# Altium schematic sheet Power.SchDoc
size A3; SheetNumber: 5; SheetTotal: 5
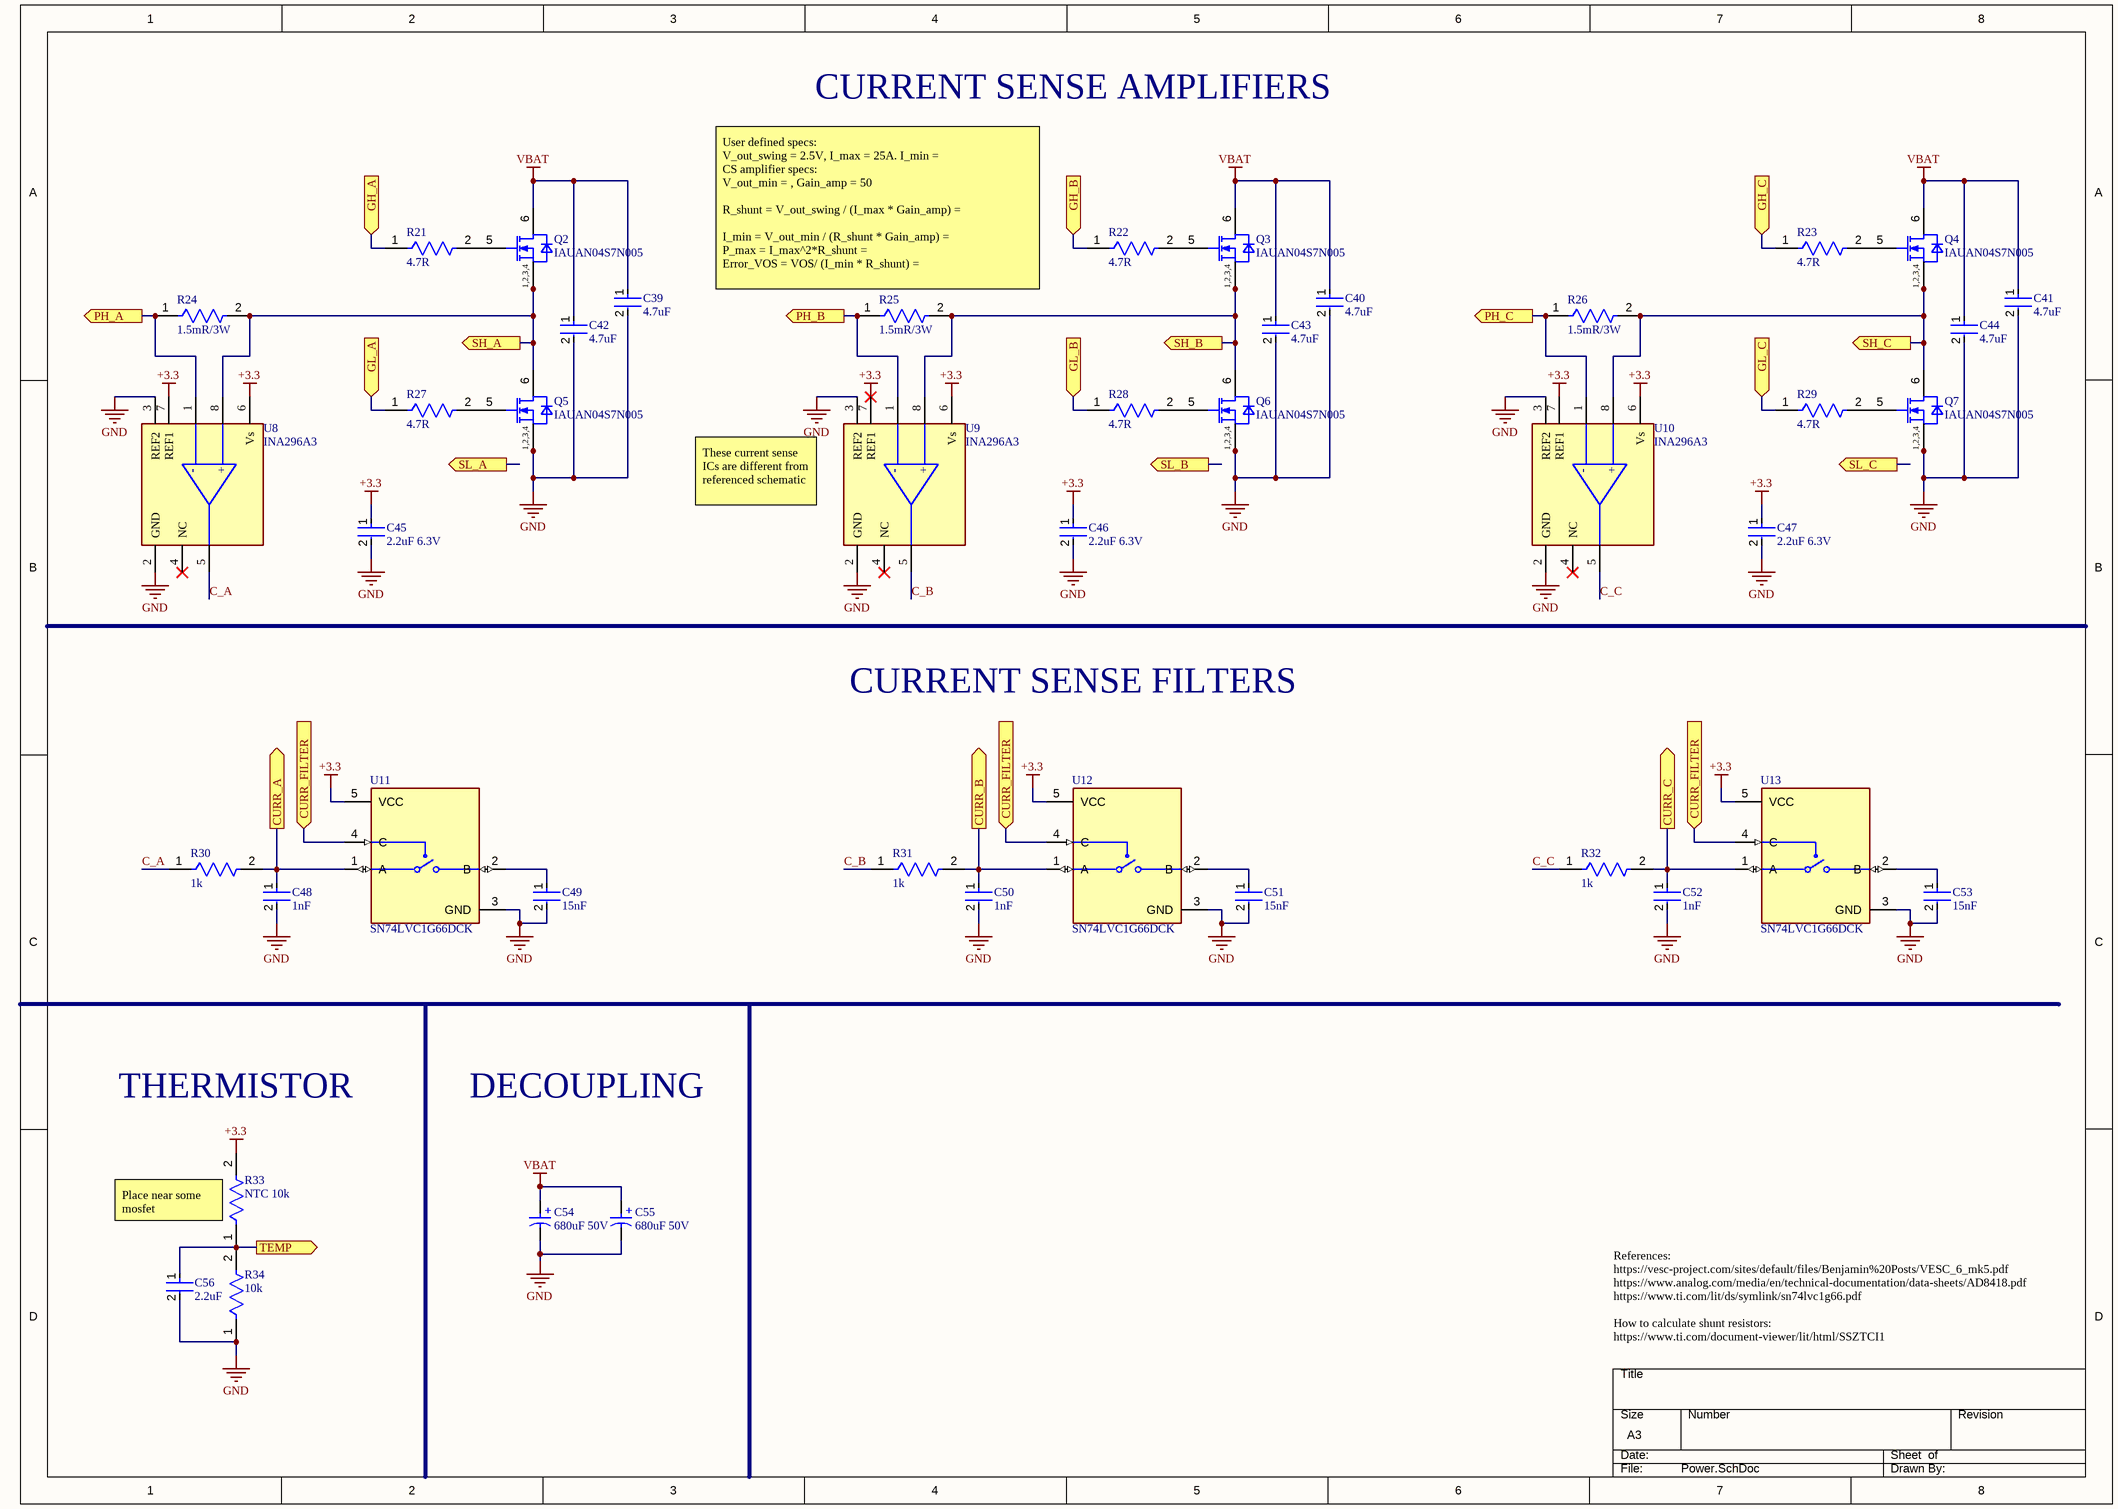
[diagram p0: Power.SchDoc]

## Parts
C39  4.7uF  [FP-CC0805-0_85-MFG]
C40  4.7uF  [FP-CC0805-0_85-MFG]
C41  4.7uF  [FP-CC0805-0_85-MFG]
C42  4.7uF  [FP-CC0805-0_85-MFG]
C43  4.7uF  [FP-CC0805-0_85-MFG]
C44  4.7uF  [FP-CC0805-0_85-MFG]
C45  2.2uF 6.3V  [FP-CC0402-MFG]
C46  2.2uF 6.3V  [FP-CC0402-MFG]
C47  2.2uF 6.3V  [FP-CC0402-MFG]
C48  1nF  [FP-CC0402-MFG]
C49  15nF  [FP-CC0402-MFG]
C50  1nF  [FP-CC0402-MFG]
C51  15nF  [FP-CC0402-MFG]
C52  1nF  [FP-CC0402-MFG]
C53  15nF  [FP-CC0402-MFG]
C54  680uF 50V  [WCAP-ATG5_D13H20_BENT_MIRROR]
C55  680uF 50V  [WCAP-ATG5_D13H20_BENT_MIRROR]
C56  2.2uF  [FP-CC0805-0_85-MFG]
Q2  IAUAN04S7N005  [IFX-PG-HSOF-5-1-V]
Q3  IAUAN04S7N005  [IFX-PG-HSOF-5-1-V]
Q4  IAUAN04S7N005  [IFX-PG-HSOF-5-1-V]
Q5  IAUAN04S7N005  [IFX-PG-HSOF-5-1-V]
Q6  IAUAN04S7N005  [IFX-PG-HSOF-5-1-V]
Q7  IAUAN04S7N005  [IFX-PG-HSOF-5-1-V]
R21  4.7R  [FP-AC0402-MFG]
R22  4.7R  [FP-AC0402-MFG]
R23  4.7R  [FP-AC0402-MFG]
R24  1.5mR/3W  [FP-AC2512-MFG]
R25  1.5mR/3W  [FP-AC2512-MFG]
R26  1.5mR/3W  [FP-AC2512-MFG]
R27  4.7R  [FP-AC0402-MFG]
R28  4.7R  [FP-AC0402-MFG]
R29  4.7R  [FP-AC0402-MFG]
R30  1k  [FP-AC0402-MFG]
R31  1k  [FP-AC0402-MFG]
R32  1k  [FP-AC0402-MFG]
R33  NTC 10k  [FP-AC0402-MFG]
R34  10k  [FP-AC0402-MFG]
U8  INA296A3  [FP-DDF0008A-MFG]
U9  INA296A3  [FP-DDF0008A-MFG]
U10  INA296A3  [FP-DDF0008A-MFG]
U11  SN74LVC1G66DCK  [FP-DCK0005A-MFG]
U12  SN74LVC1G66DCK  [FP-DCK0005A-MFG]
U13  SN74LVC1G66DCK  [FP-DCK0005A-MFG]

## Ports
CURR_A (out, see Main[4C]), CURR_B (out, see Main[4C]), CURR_C (out, see Main[4C]), CURR_FILTER (in, see Main[4C]), GH_A (in, see Main[4A], DRV8301[3B]), GH_B (in, see Main[4B], DRV8301[3B]), GH_C (in, see Main[4B], DRV8301[3B]), GL_A (in, see Main[4B], DRV8301[3B]), GL_B (in, see Main[4B], DRV8301[3B]), GL_C (in, see Main[4B], DRV8301[3B]), PH_A (out, see Main[4B]), PH_B (out, see Main[4B]), PH_C (out, see Main[4B]), SH_A (out, see Main[4B], DRV8301[1C], DRV8301[4B]), SH_B (out, see Main[4B], DRV8301[4B], DRV8301[4C]), SH_C (out, see Main[4B], DRV8301[3D], DRV8301[4B]), SL_A (out, see Main[4B]), SL_B (out, see Main[4B]), SL_C (out, see Main[4B]), TEMP (out, see Main[4C])

## Nets
+3.3: C45.1 C46.1 C47.1 R33.2 U8.6(Vs) U8.7(REF1) U9.6(Vs) U9.7(REF1) U10.6(Vs) U10.7(REF1) U11.5(VCC) U12.5(VCC) U13.5(VCC)
GND: C39.2 C40.2 C41.2 C42.2 C43.2 C44.2 C45.2 C46.2 C47.2 C48.2 C49.2 C50.2 C51.2 C52.2 C53.2 C54.2(N) C55.2(N) C56.2 Q5.1(S1) Q5.2(S2) Q5.3(S3) Q5.4(S4) Q6.1(S1) Q6.2(S2) Q6.3(S3) Q6.4(S4) Q7.1(S1) Q7.2(S2) Q7.3(S3) Q7.4(S4) R34.1 U8.2(GND) U8.3(REF2) U9.2(GND) U9.3(REF2) U10.2(GND) U10.3(REF2) U11.3(GND) U12.3(GND) U13.3(GND)
VBAT: C39.1 C40.1 C41.1 C42.1 C43.1 C44.1 C54.1(P) C55.1(P) Q2.6(D) Q3.6(D) Q4.6(D)
C_A: R30.1 U8.5(OUT)
C_B: R31.1 U9.5(OUT)
C_C: R32.1 U10.5(OUT)
CURR_A: C48.1 R30.2 U11.1(A) ; port CURR_A
CURR_B: C50.1 R31.2 U12.1(A) ; port CURR_B
CURR_C: C52.1 R32.2 U13.1(A) ; port CURR_C
CURR_FILTER: U11.4(C) U12.4(C) U13.4(C) ; port CURR_FILTER
GH_A: R21.1 ; port GH_A
GH_B: R22.1 ; port GH_B
GH_C: R23.1 ; port GH_C
GL_A: R27.1 ; port GL_A
GL_B: R28.1 ; port GL_B
GL_C: R29.1 ; port GL_C
PH_A: R24.1 U8.1(IN-) ; port PH_A
PH_B: R25.1 U9.1(IN-) ; port PH_B
PH_C: R26.1 U10.1(IN-) ; port PH_C
SH_A: Q2.1(S1) Q2.2(S2) Q2.3(S3) Q2.4(S4) Q5.6(D) R24.2 U8.8(IN+) ; port SH_A
SH_B: Q3.1(S1) Q3.2(S2) Q3.3(S3) Q3.4(S4) Q6.6(D) R25.2 U9.8(IN+) ; port SH_B
SH_C: Q4.1(S1) Q4.2(S2) Q4.3(S3) Q4.4(S4) Q7.6(D) R26.2 U10.8(IN+) ; port SH_C
TEMP: C56.1 R33.1 R34.2 ; port TEMP
NetC49_1: C49.1 U11.2(B)
NetC51_1: C51.1 U12.2(B)
NetC53_1: C53.1 U13.2(B)
NetQ2_5: Q2.5(G) R21.2
NetQ3_5: Q3.5(G) R22.2
NetQ4_5: Q4.5(G) R23.2
NetQ5_5: Q5.5(G) R27.2
NetQ6_5: Q6.5(G) R28.2
NetQ7_5: Q7.5(G) R29.2

Not connected (* = marked no-connect by the designer): U8 4(NC)*; U9 4(NC)*; U10 4(NC)*

## Notes on the sheet
- CURRENT SENSE AMPLIFIERS
- (near R25) User defined specs:
  V_out_swing = 2.5V, I_max = 25A. I_min =
  CS amplifier specs:
  V_out_min = , Gain_amp = 50
  R_shunt = V_out_swing / (I_max * Gain_amp) =
  I_min = V_out_min / (R_shunt * Gain_amp) =
  P_max = I_max^2*R_shunt =
  Error_VOS = VOS/ (I_min * R_shunt) =
- (near U9) These current sense ICs are different from referenced schematic
- CURRENT SENSE FILTERS
- THERMISTOR
- DECOUPLING
- (near R33) Place near some mosfet
- References:
  https://vesc-project.com/sites/default/files/Benjamin%20Posts/VESC_6_mk5.pdf
  https://www.analog.com/media/en/technical-documentation/data-sheets/AD8418.pdf
  https://www.ti.com/lit/ds/symlink/sn74lvc1g66.pdf
  How to calculate shunt resistors:
  https://www.ti.com/document-viewer/lit/html/SSZTCI1
- DWG. NO.
- REV.
- SHT.
- REVISION
- DESCRIPTION
- DATE
- APPROVED
- THIS DOCUMENT AND THE DATA DISCLOSED HEREIN OR HEREWITH IS THE PROPERTY OF ALTIUM LIMITED AND MAY BE FREELY DISTRIBUTED IN WHOLE. NO RIGHTS ARE RESERVED OR EXPRESS OR IMPLIED WARANTEE GIVEN.
- ENG:
- DSN:
- APPROVALS
- PROJECT
- DOCUMENT REVISION:
- DESIGN ITEM:
- CHK:
- BOM:
- REFERENCE DOCUMENTS
- PROJECT REVISION:
- TITLE
- FAB DWG:
- PCB DWG:
- ASSY DWG:
- SCALE:
- SIZE
- C
- CAGE CODE
- FILE NAME
- DWG NO.
- SHEET
- OF
- REV
- (in symbol 860020678024) +
- (in symbol IAUAN04S7N005) 1,2,3,4
- (in symbol INA296A3IDDFR) -; +

## Library data of the parts
C39-C44 = 0805B475K500NT: 4.7uF 50V X7R ±10% 0805 Multilayer Ceramic Capacitors MLCC - SMD/SMT ROHS; Manufacturer: Yageo Group; Manufacturer Part Number: CC0402KRX7R9BB682; Value: 6.8nF; Temperature Coefficient: 30ppm/°C; Supplier: DigiKey; Supplier Part Number: 311-1726-1-ND; RoHS: Compliant; Category: Ceramic Capacitors; Stock: 93415; Pricing: 1=0.1, 10=0.024, 50=0.0156, 100=0.0133, 500=0.00934, 1000=0.00812, 2500=0.00685, 5000=0.00609 (USD); Case/Package: 0402; Case Code (Imperial): 0402; Case Code (Metric): 1005; China RoHS: Compliant; Composition: Ceramic; Depth: 500µm; Dielectric: X7R; Dielectric Material: Ceramic; Halogen Free: Halogen Free; Height: 500µm; Lead Free: Lead Free; Length: 1mm; Lifecycle Status: Production; Material: Ceramic; Max Operating Temperature: 125°C; Min Operating Temperature: -55°C; Mounting Technology: Surface Mount; Pins: 2; Number of Terminals: 2; Packaging: Tape and Reel; Radiation Hardening: No; REACH SVHC: Yes; Schedule B: 8532240020, 8532240020|8532240020|8532240020|8532240020|8532240020|8532240020|8532240020|8532240020|8532240020|8532240020|8532240020|8532240020|8532240020|8532240020|8532240020|8532240020|8532240020|8532240020|8532240020|8532240020|8532240020|8532240020|8532240020|85; Termination: SMD/SMT; Thickness: 558.8µm; Tolerance: 10%; Voltage: 50V; Voltage Rating: 50V; Voltage Rating (DC): 50V; Weight: 652.039032µg; Width: 500µm; ComponentLink1URL: https://datasheet.octopart.com:443/CC0402KRX7R9BB682-Yageo-datasheet-177165144.pdf?src-supplier=IHS; ComponentLink1Description: https://datasheet.octopart.com:443/CC0402KRX7R9BB682-Yageo-datasheet-177165144.pdf?src-supplier=IHS; ComponentLink2URL: https://datasheet.octopart.com:443/CC0402KRX7R9BB682-Yageo-datasheet-78855684.pdf?src-supplier=Upverter; ComponentLink2Description: https://datasheet.octopart.com:443/CC0402KRX7R9BB682-Yageo-datasheet-78855684.pdf?src-supplier=Upverter; ComponentLink3URL: https://datasheet.octopart.com:443/CC0402KRX7R9BB682-Yageo-datasheet-147453679.pdf?src-supplier=Farnell; ComponentLink3Description: https://datasheet.octopart.com:443/CC0402KRX7R9BB682-Yageo-datasheet-147453679.pdf?src-supplier=Farnell; ComponentLink4URL: https://datasheet.octopart.com:443/CC0402KRX7R9BB682-Yageo-datasheet-182029474.pdf?src-supplier=Farnell; ComponentLink4Description: https://datasheet.octopart.com:443/CC0402KRX7R9BB682-Yageo-datasheet-182029474.pdf?src-supplier=Farnell; ComponentLink5URL: https://datasheet.octopart.com:443/CC0402KRX7R9BB682-Yageo-datasheet-140260305.pdf?src-supplier=element14+APAC; ComponentLink5Description: https://datasheet.octopart.com:443/CC0402KRX7R9BB682-Yageo-datasheet-140260305.pdf?src-supplier=element14+APAC; ComponentLink6URL: https://datasheet.octopart.com/CC0402KRX7R9BB682-Yageo-datasheet-10883670.pdf; ComponentLink6Description: https://datasheet.octopart.com/CC0402KRX7R9BB682-Yageo-datasheet-10883670.pdf; ComponentLink7URL: https://datasheet.octopart.com:443/CC0402KRX7R9BB682-Yageo-datasheet-166511530.pdf?src-supplier=Future+Electronics; ComponentLink7Description: https://datasheet.octopart.com:443/CC0402KRX7R9BB682-Yageo-datasheet-166511530.pdf?src-supplier=Future+Electronics; ComponentLink8URL: https://datasheet.octopart.com:443/CC0402KRX7R9BB682-Yageo-datasheet-137700082.pdf?src-supplier=Future+Electronics; ComponentLink8Description: https://datasheet.octopart.com:443/CC0402KRX7R9BB682-Yageo-datasheet-137700082.pdf?src-supplier=Future+Electronics; ComponentLink9URL: https://datasheet.octopart.com:443/CC0402KRX7R9BB682-Yageo-datasheet-137700084.pdf?src-supplier=Future+Electronics; ComponentLink9Description: https://datasheet.octopart.com:443/CC0402KRX7R9BB682-Yageo-datasheet-137700084.pdf?src-supplier=Future+Electronics; ComponentLink10URL: https://datasheet.octopart.com:443/CC0402KRX7R9BB682-Yageo-datasheet-27626582.pdf?src-supplier=Future+Electronics; ComponentLink10Description: https://datasheet.octopart.com:443/CC0402KRX7R9BB682-Yageo-datasheet-27626582.pdf?src-supplier=Future+Electronics; ComponentLink11URL: https://datasheet.octopart.com:443/CC0402KRX7R9BB682-Yageo-datasheet-24578986.pdf?src-supplier=Future+Electronics; ComponentLink11Description: https://datasheet.octopart.com:443/CC0402KRX7R9BB682-Yageo-datasheet-24578986.pdf?src-supplier=Future+Electronics; ComponentLink12URL: https://datasheet.octopart.com:443/CC0402KRX7R9BB682-Yageo-datasheet-15895757.pdf?src-supplier=Future+Electronics; ComponentLink12Description: https://datasheet.octopart.com:443/CC0402KRX7R9BB682-Yageo-datasheet-15895757.pdf?src-supplier=Future+Electronics; ComponentLink13URL: https://datasheet.octopart.com:443/CC0402KRX7R9BB682-Yageo-datasheet-12526321.pdf?src-supplier=Future+Electronics; ComponentLink13Description: https://datasheet.octopart.com:443/CC0402KRX7R9BB682-Yageo-datasheet-12526321.pdf?src-supplier=Future+Electronics; ComponentLink14URL: https://datasheet.octopart.com:443/CC0402KRX7R9BB682-Yageo-datasheet-178018872.pdf?src-supplier=Burklin+Elektronik; ComponentLink14Description: https://datasheet.octopart.com:443/CC0402KRX7R9BB682-Yageo-datasheet-178018872.pdf?src-supplier=Burklin+Elektronik; ComponentLink15URL: https://datasheet.octopart.com:443/CC0402KRX7R9BB682-Yageo-Group-datasheet-165992755.pdf?src-supplier=ODG+(Origin+Data+Global); ComponentLink15Description: https://datasheet.octopart.com:443/CC0402KRX7R9BB682-Yageo-Group-datasheet-165992755.pdf?src-supplier=ODG+(Origin+Data+Global); ComponentLink16URL: https://datasheet.octopart.com:443/CC0402KRX7R9BB682-Yageo-datasheet-120101875.pdf?src-supplier=Megastar; ComponentLink16Description: https://datasheet.octopart.com:443/CC0402KRX7R9BB682-Yageo-datasheet-120101875.pdf?src-supplier=Megastar; ComponentLink17URL: https://datasheet.octopart.com:443/CC0402KRX7R9BB682-Yageo-datasheet-62336348.pdf?src-supplier=Newark; ComponentLink17Description: https://datasheet.octopart.com:443/CC0402KRX7R9BB682-Yageo-datasheet-62336348.pdf?src-supplier=Newark; ComponentLink18URL: http://sigma.octopart.com:80/conflict_mineral_statement/Yageo-company-3.pdf?src-supplier=Compliance+Statements; ComponentLink18Description: http://sigma.octopart.com:80/conflict_mineral_statement/Yageo-company-3.pdf?src-supplier=Compliance+Statements; ComponentLink19URL: http://sigma.octopart.com:80/rohs_statement/Yageo-company-2.pdf?src-supplier=Compliance+Statements; ComponentLink19Description: http://sigma.octopart.com:80/rohs_statement/Yageo-company-2.pdf?src-supplier=Compliance+Statements
C45-C47 = CL05A225MQ5NSNC: 2.2uF 6.3V X5R ±20% 0402 Multilayer Ceramic Capacitors MLCC - SMD/SMT ROHS; Manufacturer: Yageo Group; Manufacturer Part Number: CC0402KRX7R9BB682; Value: 6.8nF; Dielectric: X7R; Temperature Coefficient: 30ppm/°C; Tolerance: 10%; Voltage: 50V; Supplier: DigiKey; Supplier Part Number: 311-1726-1-ND; RoHS: Compliant; Category: Ceramic Capacitors; Stock: 93415; Pricing: 1=0.1, 10=0.024, 50=0.0156, 100=0.0133, 500=0.00934, 1000=0.00812, 2500=0.00685, 5000=0.00609 (USD); Case/Package: 0402; Case Code (Imperial): 0402; Case Code (Metric): 1005; China RoHS: Compliant; Composition: Ceramic; Depth: 500µm; Dielectric Material: Ceramic; Halogen Free: Halogen Free; Height: 500µm; Lead Free: Lead Free; Length: 1mm; Lifecycle Status: Production; Material: Ceramic; Max Operating Temperature: 125°C; Min Operating Temperature: -55°C; Mounting Technology: Surface Mount; Pins: 2; Number of Terminals: 2; Packaging: Tape and Reel; Radiation Hardening: No; REACH SVHC: Yes; Schedule B: 8532240020, 8532240020|8532240020|8532240020|8532240020|8532240020|8532240020|8532240020|8532240020|8532240020|8532240020|8532240020|8532240020|8532240020|8532240020|8532240020|8532240020|8532240020|8532240020|8532240020|8532240020|8532240020|8532240020|8532240020|85; Termination: SMD/SMT; Thickness: 558.8µm; Voltage Rating: 50V; Voltage Rating (DC): 50V; Weight: 652.039032µg; Width: 500µm; ComponentLink1URL: https://datasheet.octopart.com:443/CC0402KRX7R9BB682-Yageo-datasheet-177165144.pdf?src-supplier=IHS; ComponentLink1Description: https://datasheet.octopart.com:443/CC0402KRX7R9BB682-Yageo-datasheet-177165144.pdf?src-supplier=IHS; ComponentLink2URL: https://datasheet.octopart.com:443/CC0402KRX7R9BB682-Yageo-datasheet-78855684.pdf?src-supplier=Upverter; ComponentLink2Description: https://datasheet.octopart.com:443/CC0402KRX7R9BB682-Yageo-datasheet-78855684.pdf?src-supplier=Upverter; ComponentLink3URL: https://datasheet.octopart.com:443/CC0402KRX7R9BB682-Yageo-datasheet-147453679.pdf?src-supplier=Farnell; ComponentLink3Description: https://datasheet.octopart.com:443/CC0402KRX7R9BB682-Yageo-datasheet-147453679.pdf?src-supplier=Farnell; ComponentLink4URL: https://datasheet.octopart.com:443/CC0402KRX7R9BB682-Yageo-datasheet-182029474.pdf?src-supplier=Farnell; ComponentLink4Description: https://datasheet.octopart.com:443/CC0402KRX7R9BB682-Yageo-datasheet-182029474.pdf?src-supplier=Farnell; ComponentLink5URL: https://datasheet.octopart.com:443/CC0402KRX7R9BB682-Yageo-datasheet-140260305.pdf?src-supplier=element14+APAC; ComponentLink5Description: https://datasheet.octopart.com:443/CC0402KRX7R9BB682-Yageo-datasheet-140260305.pdf?src-supplier=element14+APAC; ComponentLink6URL: https://datasheet.octopart.com/CC0402KRX7R9BB682-Yageo-datasheet-10883670.pdf; ComponentLink6Description: https://datasheet.octopart.com/CC0402KRX7R9BB682-Yageo-datasheet-10883670.pdf; ComponentLink7URL: https://datasheet.octopart.com:443/CC0402KRX7R9BB682-Yageo-datasheet-166511530.pdf?src-supplier=Future+Electronics; ComponentLink7Description: https://datasheet.octopart.com:443/CC0402KRX7R9BB682-Yageo-datasheet-166511530.pdf?src-supplier=Future+Electronics; ComponentLink8URL: https://datasheet.octopart.com:443/CC0402KRX7R9BB682-Yageo-datasheet-137700082.pdf?src-supplier=Future+Electronics; ComponentLink8Description: https://datasheet.octopart.com:443/CC0402KRX7R9BB682-Yageo-datasheet-137700082.pdf?src-supplier=Future+Electronics; ComponentLink9URL: https://datasheet.octopart.com:443/CC0402KRX7R9BB682-Yageo-datasheet-137700084.pdf?src-supplier=Future+Electronics; ComponentLink9Description: https://datasheet.octopart.com:443/CC0402KRX7R9BB682-Yageo-datasheet-137700084.pdf?src-supplier=Future+Electronics; ComponentLink10URL: https://datasheet.octopart.com:443/CC0402KRX7R9BB682-Yageo-datasheet-27626582.pdf?src-supplier=Future+Electronics; ComponentLink10Description: https://datasheet.octopart.com:443/CC0402KRX7R9BB682-Yageo-datasheet-27626582.pdf?src-supplier=Future+Electronics; ComponentLink11URL: https://datasheet.octopart.com:443/CC0402KRX7R9BB682-Yageo-datasheet-24578986.pdf?src-supplier=Future+Electronics; ComponentLink11Description: https://datasheet.octopart.com:443/CC0402KRX7R9BB682-Yageo-datasheet-24578986.pdf?src-supplier=Future+Electronics; ComponentLink12URL: https://datasheet.octopart.com:443/CC0402KRX7R9BB682-Yageo-datasheet-15895757.pdf?src-supplier=Future+Electronics; ComponentLink12Description: https://datasheet.octopart.com:443/CC0402KRX7R9BB682-Yageo-datasheet-15895757.pdf?src-supplier=Future+Electronics; ComponentLink13URL: https://datasheet.octopart.com:443/CC0402KRX7R9BB682-Yageo-datasheet-12526321.pdf?src-supplier=Future+Electronics; ComponentLink13Description: https://datasheet.octopart.com:443/CC0402KRX7R9BB682-Yageo-datasheet-12526321.pdf?src-supplier=Future+Electronics; ComponentLink14URL: https://datasheet.octopart.com:443/CC0402KRX7R9BB682-Yageo-datasheet-178018872.pdf?src-supplier=Burklin+Elektronik; ComponentLink14Description: https://datasheet.octopart.com:443/CC0402KRX7R9BB682-Yageo-datasheet-178018872.pdf?src-supplier=Burklin+Elektronik; ComponentLink15URL: https://datasheet.octopart.com:443/CC0402KRX7R9BB682-Yageo-Group-datasheet-165992755.pdf?src-supplier=ODG+(Origin+Data+Global); ComponentLink15Description: https://datasheet.octopart.com:443/CC0402KRX7R9BB682-Yageo-Group-datasheet-165992755.pdf?src-supplier=ODG+(Origin+Data+Global); ComponentLink16URL: https://datasheet.octopart.com:443/CC0402KRX7R9BB682-Yageo-datasheet-120101875.pdf?src-supplier=Megastar; ComponentLink16Description: https://datasheet.octopart.com:443/CC0402KRX7R9BB682-Yageo-datasheet-120101875.pdf?src-supplier=Megastar; ComponentLink17URL: https://datasheet.octopart.com:443/CC0402KRX7R9BB682-Yageo-datasheet-62336348.pdf?src-supplier=Newark; ComponentLink17Description: https://datasheet.octopart.com:443/CC0402KRX7R9BB682-Yageo-datasheet-62336348.pdf?src-supplier=Newark; ComponentLink18URL: http://sigma.octopart.com:80/conflict_mineral_statement/Yageo-company-3.pdf?src-supplier=Compliance+Statements; ComponentLink18Description: http://sigma.octopart.com:80/conflict_mineral_statement/Yageo-company-3.pdf?src-supplier=Compliance+Statements; ComponentLink19URL: http://sigma.octopart.com:80/rohs_statement/Yageo-company-2.pdf?src-supplier=Compliance+Statements; ComponentLink19Description: http://sigma.octopart.com:80/rohs_statement/Yageo-company-2.pdf?src-supplier=Compliance+Statements
C48 C50 C52 = 0402B102K500NT: 1nF 50V X7R ±10% 0402 Multilayer Ceramic Capacitors MLCC - SMD/SMT ROHS; Manufacturer: Yageo Group; Manufacturer Part Number: CC0402KRX7R9BB682; Value: 6.8nF; Temperature Coefficient: 30ppm/°C; Supplier: DigiKey; Supplier Part Number: 311-1726-1-ND; RoHS: Compliant; Category: Ceramic Capacitors; Stock: 93415; Pricing: 1=0.1, 10=0.024, 50=0.0156, 100=0.0133, 500=0.00934, 1000=0.00812, 2500=0.00685, 5000=0.00609 (USD); Case/Package: 0402; Case Code (Imperial): 0402; Case Code (Metric): 1005; China RoHS: Compliant; Composition: Ceramic; Depth: 500µm; Dielectric: X7R; Dielectric Material: Ceramic; Halogen Free: Halogen Free; Height: 500µm; Lead Free: Lead Free; Length: 1mm; Lifecycle Status: Production; Material: Ceramic; Max Operating Temperature: 125°C; Min Operating Temperature: -55°C; Mounting Technology: Surface Mount; Pins: 2; Number of Terminals: 2; Packaging: Tape and Reel; Radiation Hardening: No; REACH SVHC: Yes; Schedule B: 8532240020, 8532240020|8532240020|8532240020|8532240020|8532240020|8532240020|8532240020|8532240020|8532240020|8532240020|8532240020|8532240020|8532240020|8532240020|8532240020|8532240020|8532240020|8532240020|8532240020|8532240020|8532240020|8532240020|8532240020|85; Termination: SMD/SMT; Thickness: 558.8µm; Tolerance: 10%; Voltage: 50V; Voltage Rating: 50V; Voltage Rating (DC): 50V; Weight: 652.039032µg; Width: 500µm; ComponentLink1URL: https://datasheet.octopart.com:443/CC0402KRX7R9BB682-Yageo-datasheet-177165144.pdf?src-supplier=IHS; ComponentLink1Description: https://datasheet.octopart.com:443/CC0402KRX7R9BB682-Yageo-datasheet-177165144.pdf?src-supplier=IHS; ComponentLink2URL: https://datasheet.octopart.com:443/CC0402KRX7R9BB682-Yageo-datasheet-78855684.pdf?src-supplier=Upverter; ComponentLink2Description: https://datasheet.octopart.com:443/CC0402KRX7R9BB682-Yageo-datasheet-78855684.pdf?src-supplier=Upverter; ComponentLink3URL: https://datasheet.octopart.com:443/CC0402KRX7R9BB682-Yageo-datasheet-147453679.pdf?src-supplier=Farnell; ComponentLink3Description: https://datasheet.octopart.com:443/CC0402KRX7R9BB682-Yageo-datasheet-147453679.pdf?src-supplier=Farnell; ComponentLink4URL: https://datasheet.octopart.com:443/CC0402KRX7R9BB682-Yageo-datasheet-182029474.pdf?src-supplier=Farnell; ComponentLink4Description: https://datasheet.octopart.com:443/CC0402KRX7R9BB682-Yageo-datasheet-182029474.pdf?src-supplier=Farnell; ComponentLink5URL: https://datasheet.octopart.com:443/CC0402KRX7R9BB682-Yageo-datasheet-140260305.pdf?src-supplier=element14+APAC; ComponentLink5Description: https://datasheet.octopart.com:443/CC0402KRX7R9BB682-Yageo-datasheet-140260305.pdf?src-supplier=element14+APAC; ComponentLink6URL: https://datasheet.octopart.com/CC0402KRX7R9BB682-Yageo-datasheet-10883670.pdf; ComponentLink6Description: https://datasheet.octopart.com/CC0402KRX7R9BB682-Yageo-datasheet-10883670.pdf; ComponentLink7URL: https://datasheet.octopart.com:443/CC0402KRX7R9BB682-Yageo-datasheet-166511530.pdf?src-supplier=Future+Electronics; ComponentLink7Description: https://datasheet.octopart.com:443/CC0402KRX7R9BB682-Yageo-datasheet-166511530.pdf?src-supplier=Future+Electronics; ComponentLink8URL: https://datasheet.octopart.com:443/CC0402KRX7R9BB682-Yageo-datasheet-137700082.pdf?src-supplier=Future+Electronics; ComponentLink8Description: https://datasheet.octopart.com:443/CC0402KRX7R9BB682-Yageo-datasheet-137700082.pdf?src-supplier=Future+Electronics; ComponentLink9URL: https://datasheet.octopart.com:443/CC0402KRX7R9BB682-Yageo-datasheet-137700084.pdf?src-supplier=Future+Electronics; ComponentLink9Description: https://datasheet.octopart.com:443/CC0402KRX7R9BB682-Yageo-datasheet-137700084.pdf?src-supplier=Future+Electronics; ComponentLink10URL: https://datasheet.octopart.com:443/CC0402KRX7R9BB682-Yageo-datasheet-27626582.pdf?src-supplier=Future+Electronics; ComponentLink10Description: https://datasheet.octopart.com:443/CC0402KRX7R9BB682-Yageo-datasheet-27626582.pdf?src-supplier=Future+Electronics; ComponentLink11URL: https://datasheet.octopart.com:443/CC0402KRX7R9BB682-Yageo-datasheet-24578986.pdf?src-supplier=Future+Electronics; ComponentLink11Description: https://datasheet.octopart.com:443/CC0402KRX7R9BB682-Yageo-datasheet-24578986.pdf?src-supplier=Future+Electronics; ComponentLink12URL: https://datasheet.octopart.com:443/CC0402KRX7R9BB682-Yageo-datasheet-15895757.pdf?src-supplier=Future+Electronics; ComponentLink12Description: https://datasheet.octopart.com:443/CC0402KRX7R9BB682-Yageo-datasheet-15895757.pdf?src-supplier=Future+Electronics; ComponentLink13URL: https://datasheet.octopart.com:443/CC0402KRX7R9BB682-Yageo-datasheet-12526321.pdf?src-supplier=Future+Electronics; ComponentLink13Description: https://datasheet.octopart.com:443/CC0402KRX7R9BB682-Yageo-datasheet-12526321.pdf?src-supplier=Future+Electronics; ComponentLink14URL: https://datasheet.octopart.com:443/CC0402KRX7R9BB682-Yageo-datasheet-178018872.pdf?src-supplier=Burklin+Elektronik; ComponentLink14Description: https://datasheet.octopart.com:443/CC0402KRX7R9BB682-Yageo-datasheet-178018872.pdf?src-supplier=Burklin+Elektronik; ComponentLink15URL: https://datasheet.octopart.com:443/CC0402KRX7R9BB682-Yageo-Group-datasheet-165992755.pdf?src-supplier=ODG+(Origin+Data+Global); ComponentLink15Description: https://datasheet.octopart.com:443/CC0402KRX7R9BB682-Yageo-Group-datasheet-165992755.pdf?src-supplier=ODG+(Origin+Data+Global); ComponentLink16URL: https://datasheet.octopart.com:443/CC0402KRX7R9BB682-Yageo-datasheet-120101875.pdf?src-supplier=Megastar; ComponentLink16Description: https://datasheet.octopart.com:443/CC0402KRX7R9BB682-Yageo-datasheet-120101875.pdf?src-supplier=Megastar; ComponentLink17URL: https://datasheet.octopart.com:443/CC0402KRX7R9BB682-Yageo-datasheet-62336348.pdf?src-supplier=Newark; ComponentLink17Description: https://datasheet.octopart.com:443/CC0402KRX7R9BB682-Yageo-datasheet-62336348.pdf?src-supplier=Newark; ComponentLink18URL: http://sigma.octopart.com:80/conflict_mineral_statement/Yageo-company-3.pdf?src-supplier=Compliance+Statements; ComponentLink18Description: http://sigma.octopart.com:80/conflict_mineral_statement/Yageo-company-3.pdf?src-supplier=Compliance+Statements; ComponentLink19URL: http://sigma.octopart.com:80/rohs_statement/Yageo-company-2.pdf?src-supplier=Compliance+Statements; ComponentLink19Description: http://sigma.octopart.com:80/rohs_statement/Yageo-company-2.pdf?src-supplier=Compliance+Statements
C49 C51 C53 = CC0402KRX7R9BB153: 15nF 50V X7R ±10% 0402 Multilayer Ceramic Capacitors MLCC - SMD/SMT ROHS; Manufacturer: Yageo Group; Manufacturer Part Number: CC0402KRX7R9BB682; Value: 6.8nF; Temperature Coefficient: 30ppm/°C; Supplier: DigiKey; Supplier Part Number: 311-1726-1-ND; RoHS: Compliant; Category: Ceramic Capacitors; Stock: 93415; Pricing: 1=0.1, 10=0.024, 50=0.0156, 100=0.0133, 500=0.00934, 1000=0.00812, 2500=0.00685, 5000=0.00609 (USD); Case/Package: 0402; Case Code (Imperial): 0402; Case Code (Metric): 1005; China RoHS: Compliant; Composition: Ceramic; Depth: 500µm; Dielectric: X7R; Dielectric Material: Ceramic; Halogen Free: Halogen Free; Height: 500µm; Lead Free: Lead Free; Length: 1mm; Lifecycle Status: Production; Material: Ceramic; Max Operating Temperature: 125°C; Min Operating Temperature: -55°C; Mounting Technology: Surface Mount; Pins: 2; Number of Terminals: 2; Packaging: Tape and Reel; Radiation Hardening: No; REACH SVHC: Yes; Schedule B: 8532240020, 8532240020|8532240020|8532240020|8532240020|8532240020|8532240020|8532240020|8532240020|8532240020|8532240020|8532240020|8532240020|8532240020|8532240020|8532240020|8532240020|8532240020|8532240020|8532240020|8532240020|8532240020|8532240020|8532240020|85; Termination: SMD/SMT; Thickness: 558.8µm; Tolerance: 10%; Voltage: 50V; Voltage Rating: 50V; Voltage Rating (DC): 50V; Weight: 652.039032µg; Width: 500µm; ComponentLink1URL: https://datasheet.octopart.com:443/CC0402KRX7R9BB682-Yageo-datasheet-177165144.pdf?src-supplier=IHS; ComponentLink1Description: https://datasheet.octopart.com:443/CC0402KRX7R9BB682-Yageo-datasheet-177165144.pdf?src-supplier=IHS; ComponentLink2URL: https://datasheet.octopart.com:443/CC0402KRX7R9BB682-Yageo-datasheet-78855684.pdf?src-supplier=Upverter; ComponentLink2Description: https://datasheet.octopart.com:443/CC0402KRX7R9BB682-Yageo-datasheet-78855684.pdf?src-supplier=Upverter; ComponentLink3URL: https://datasheet.octopart.com:443/CC0402KRX7R9BB682-Yageo-datasheet-147453679.pdf?src-supplier=Farnell; ComponentLink3Description: https://datasheet.octopart.com:443/CC0402KRX7R9BB682-Yageo-datasheet-147453679.pdf?src-supplier=Farnell; ComponentLink4URL: https://datasheet.octopart.com:443/CC0402KRX7R9BB682-Yageo-datasheet-182029474.pdf?src-supplier=Farnell; ComponentLink4Description: https://datasheet.octopart.com:443/CC0402KRX7R9BB682-Yageo-datasheet-182029474.pdf?src-supplier=Farnell; ComponentLink5URL: https://datasheet.octopart.com:443/CC0402KRX7R9BB682-Yageo-datasheet-140260305.pdf?src-supplier=element14+APAC; ComponentLink5Description: https://datasheet.octopart.com:443/CC0402KRX7R9BB682-Yageo-datasheet-140260305.pdf?src-supplier=element14+APAC; ComponentLink6URL: https://datasheet.octopart.com/CC0402KRX7R9BB682-Yageo-datasheet-10883670.pdf; ComponentLink6Description: https://datasheet.octopart.com/CC0402KRX7R9BB682-Yageo-datasheet-10883670.pdf; ComponentLink7URL: https://datasheet.octopart.com:443/CC0402KRX7R9BB682-Yageo-datasheet-166511530.pdf?src-supplier=Future+Electronics; ComponentLink7Description: https://datasheet.octopart.com:443/CC0402KRX7R9BB682-Yageo-datasheet-166511530.pdf?src-supplier=Future+Electronics; ComponentLink8URL: https://datasheet.octopart.com:443/CC0402KRX7R9BB682-Yageo-datasheet-137700082.pdf?src-supplier=Future+Electronics; ComponentLink8Description: https://datasheet.octopart.com:443/CC0402KRX7R9BB682-Yageo-datasheet-137700082.pdf?src-supplier=Future+Electronics; ComponentLink9URL: https://datasheet.octopart.com:443/CC0402KRX7R9BB682-Yageo-datasheet-137700084.pdf?src-supplier=Future+Electronics; ComponentLink9Description: https://datasheet.octopart.com:443/CC0402KRX7R9BB682-Yageo-datasheet-137700084.pdf?src-supplier=Future+Electronics; ComponentLink10URL: https://datasheet.octopart.com:443/CC0402KRX7R9BB682-Yageo-datasheet-27626582.pdf?src-supplier=Future+Electronics; ComponentLink10Description: https://datasheet.octopart.com:443/CC0402KRX7R9BB682-Yageo-datasheet-27626582.pdf?src-supplier=Future+Electronics; ComponentLink11URL: https://datasheet.octopart.com:443/CC0402KRX7R9BB682-Yageo-datasheet-24578986.pdf?src-supplier=Future+Electronics; ComponentLink11Description: https://datasheet.octopart.com:443/CC0402KRX7R9BB682-Yageo-datasheet-24578986.pdf?src-supplier=Future+Electronics; ComponentLink12URL: https://datasheet.octopart.com:443/CC0402KRX7R9BB682-Yageo-datasheet-15895757.pdf?src-supplier=Future+Electronics; ComponentLink12Description: https://datasheet.octopart.com:443/CC0402KRX7R9BB682-Yageo-datasheet-15895757.pdf?src-supplier=Future+Electronics; ComponentLink13URL: https://datasheet.octopart.com:443/CC0402KRX7R9BB682-Yageo-datasheet-12526321.pdf?src-supplier=Future+Electronics; ComponentLink13Description: https://datasheet.octopart.com:443/CC0402KRX7R9BB682-Yageo-datasheet-12526321.pdf?src-supplier=Future+Electronics; ComponentLink14URL: https://datasheet.octopart.com:443/CC0402KRX7R9BB682-Yageo-datasheet-178018872.pdf?src-supplier=Burklin+Elektronik; ComponentLink14Description: https://datasheet.octopart.com:443/CC0402KRX7R9BB682-Yageo-datasheet-178018872.pdf?src-supplier=Burklin+Elektronik; ComponentLink15URL: https://datasheet.octopart.com:443/CC0402KRX7R9BB682-Yageo-Group-datasheet-165992755.pdf?src-supplier=ODG+(Origin+Data+Global); ComponentLink15Description: https://datasheet.octopart.com:443/CC0402KRX7R9BB682-Yageo-Group-datasheet-165992755.pdf?src-supplier=ODG+(Origin+Data+Global); ComponentLink16URL: https://datasheet.octopart.com:443/CC0402KRX7R9BB682-Yageo-datasheet-120101875.pdf?src-supplier=Megastar; ComponentLink16Description: https://datasheet.octopart.com:443/CC0402KRX7R9BB682-Yageo-datasheet-120101875.pdf?src-supplier=Megastar; ComponentLink17URL: https://datasheet.octopart.com:443/CC0402KRX7R9BB682-Yageo-datasheet-62336348.pdf?src-supplier=Newark; ComponentLink17Description: https://datasheet.octopart.com:443/CC0402KRX7R9BB682-Yageo-datasheet-62336348.pdf?src-supplier=Newark; ComponentLink18URL: http://sigma.octopart.com:80/conflict_mineral_statement/Yageo-company-3.pdf?src-supplier=Compliance+Statements; ComponentLink18Description: http://sigma.octopart.com:80/conflict_mineral_statement/Yageo-company-3.pdf?src-supplier=Compliance+Statements; ComponentLink19URL: http://sigma.octopart.com:80/rohs_statement/Yageo-company-2.pdf?src-supplier=Compliance+Statements; ComponentLink19Description: http://sigma.octopart.com:80/rohs_statement/Yageo-company-2.pdf?src-supplier=Compliance+Statements
C54 C55 = 860020678024: Aluminium Electrolytic Capacitors - Radial Leaded WCAP-ATG5 680uF 50V 20% Radial
C56 = CC0805KKX7R9BB225: 2.2uF 50V X7R ±10% 0805 Multilayer Ceramic Capacitors MLCC - SMD/SMT ROHS; Manufacturer: Yageo Group; Manufacturer Part Number: CC0402KRX7R9BB682; Value: 6.8nF; Temperature Coefficient: 30ppm/°C; Supplier: DigiKey; Supplier Part Number: 311-1726-1-ND; RoHS: Compliant; Category: Ceramic Capacitors; Stock: 93415; Pricing: 1=0.1, 10=0.024, 50=0.0156, 100=0.0133, 500=0.00934, 1000=0.00812, 2500=0.00685, 5000=0.00609 (USD); Case/Package: 0402; Case Code (Imperial): 0402; Case Code (Metric): 1005; China RoHS: Compliant; Composition: Ceramic; Depth: 500µm; Dielectric: X7R; Dielectric Material: Ceramic; Halogen Free: Halogen Free; Height: 500µm; Lead Free: Lead Free; Length: 1mm; Lifecycle Status: Production; Material: Ceramic; Max Operating Temperature: 125°C; Min Operating Temperature: -55°C; Mounting Technology: Surface Mount; Pins: 2; Number of Terminals: 2; Packaging: Tape and Reel; Radiation Hardening: No; REACH SVHC: Yes; Schedule B: 8532240020, 8532240020|8532240020|8532240020|8532240020|8532240020|8532240020|8532240020|8532240020|8532240020|8532240020|8532240020|8532240020|8532240020|8532240020|8532240020|8532240020|8532240020|8532240020|8532240020|8532240020|8532240020|8532240020|8532240020|85; Termination: SMD/SMT; Thickness: 558.8µm; Tolerance: 10%; Voltage: 50V; Voltage Rating: 50V; Voltage Rating (DC): 50V; Weight: 652.039032µg; Width: 500µm; ComponentLink1URL: https://datasheet.octopart.com:443/CC0402KRX7R9BB682-Yageo-datasheet-177165144.pdf?src-supplier=IHS; ComponentLink1Description: https://datasheet.octopart.com:443/CC0402KRX7R9BB682-Yageo-datasheet-177165144.pdf?src-supplier=IHS; ComponentLink2URL: https://datasheet.octopart.com:443/CC0402KRX7R9BB682-Yageo-datasheet-78855684.pdf?src-supplier=Upverter; ComponentLink2Description: https://datasheet.octopart.com:443/CC0402KRX7R9BB682-Yageo-datasheet-78855684.pdf?src-supplier=Upverter; ComponentLink3URL: https://datasheet.octopart.com:443/CC0402KRX7R9BB682-Yageo-datasheet-147453679.pdf?src-supplier=Farnell; ComponentLink3Description: https://datasheet.octopart.com:443/CC0402KRX7R9BB682-Yageo-datasheet-147453679.pdf?src-supplier=Farnell; ComponentLink4URL: https://datasheet.octopart.com:443/CC0402KRX7R9BB682-Yageo-datasheet-182029474.pdf?src-supplier=Farnell; ComponentLink4Description: https://datasheet.octopart.com:443/CC0402KRX7R9BB682-Yageo-datasheet-182029474.pdf?src-supplier=Farnell; ComponentLink5URL: https://datasheet.octopart.com:443/CC0402KRX7R9BB682-Yageo-datasheet-140260305.pdf?src-supplier=element14+APAC; ComponentLink5Description: https://datasheet.octopart.com:443/CC0402KRX7R9BB682-Yageo-datasheet-140260305.pdf?src-supplier=element14+APAC; ComponentLink6URL: https://datasheet.octopart.com/CC0402KRX7R9BB682-Yageo-datasheet-10883670.pdf; ComponentLink6Description: https://datasheet.octopart.com/CC0402KRX7R9BB682-Yageo-datasheet-10883670.pdf; ComponentLink7URL: https://datasheet.octopart.com:443/CC0402KRX7R9BB682-Yageo-datasheet-166511530.pdf?src-supplier=Future+Electronics; ComponentLink7Description: https://datasheet.octopart.com:443/CC0402KRX7R9BB682-Yageo-datasheet-166511530.pdf?src-supplier=Future+Electronics; ComponentLink8URL: https://datasheet.octopart.com:443/CC0402KRX7R9BB682-Yageo-datasheet-137700082.pdf?src-supplier=Future+Electronics; ComponentLink8Description: https://datasheet.octopart.com:443/CC0402KRX7R9BB682-Yageo-datasheet-137700082.pdf?src-supplier=Future+Electronics; ComponentLink9URL: https://datasheet.octopart.com:443/CC0402KRX7R9BB682-Yageo-datasheet-137700084.pdf?src-supplier=Future+Electronics; ComponentLink9Description: https://datasheet.octopart.com:443/CC0402KRX7R9BB682-Yageo-datasheet-137700084.pdf?src-supplier=Future+Electronics; ComponentLink10URL: https://datasheet.octopart.com:443/CC0402KRX7R9BB682-Yageo-datasheet-27626582.pdf?src-supplier=Future+Electronics; ComponentLink10Description: https://datasheet.octopart.com:443/CC0402KRX7R9BB682-Yageo-datasheet-27626582.pdf?src-supplier=Future+Electronics; ComponentLink11URL: https://datasheet.octopart.com:443/CC0402KRX7R9BB682-Yageo-datasheet-24578986.pdf?src-supplier=Future+Electronics; ComponentLink11Description: https://datasheet.octopart.com:443/CC0402KRX7R9BB682-Yageo-datasheet-24578986.pdf?src-supplier=Future+Electronics; ComponentLink12URL: https://datasheet.octopart.com:443/CC0402KRX7R9BB682-Yageo-datasheet-15895757.pdf?src-supplier=Future+Electronics; ComponentLink12Description: https://datasheet.octopart.com:443/CC0402KRX7R9BB682-Yageo-datasheet-15895757.pdf?src-supplier=Future+Electronics; ComponentLink13URL: https://datasheet.octopart.com:443/CC0402KRX7R9BB682-Yageo-datasheet-12526321.pdf?src-supplier=Future+Electronics; ComponentLink13Description: https://datasheet.octopart.com:443/CC0402KRX7R9BB682-Yageo-datasheet-12526321.pdf?src-supplier=Future+Electronics; ComponentLink14URL: https://datasheet.octopart.com:443/CC0402KRX7R9BB682-Yageo-datasheet-178018872.pdf?src-supplier=Burklin+Elektronik; ComponentLink14Description: https://datasheet.octopart.com:443/CC0402KRX7R9BB682-Yageo-datasheet-178018872.pdf?src-supplier=Burklin+Elektronik; ComponentLink15URL: https://datasheet.octopart.com:443/CC0402KRX7R9BB682-Yageo-Group-datasheet-165992755.pdf?src-supplier=ODG+(Origin+Data+Global); ComponentLink15Description: https://datasheet.octopart.com:443/CC0402KRX7R9BB682-Yageo-Group-datasheet-165992755.pdf?src-supplier=ODG+(Origin+Data+Global); ComponentLink16URL: https://datasheet.octopart.com:443/CC0402KRX7R9BB682-Yageo-datasheet-120101875.pdf?src-supplier=Megastar; ComponentLink16Description: https://datasheet.octopart.com:443/CC0402KRX7R9BB682-Yageo-datasheet-120101875.pdf?src-supplier=Megastar; ComponentLink17URL: https://datasheet.octopart.com:443/CC0402KRX7R9BB682-Yageo-datasheet-62336348.pdf?src-supplier=Newark; ComponentLink17Description: https://datasheet.octopart.com:443/CC0402KRX7R9BB682-Yageo-datasheet-62336348.pdf?src-supplier=Newark; ComponentLink18URL: http://sigma.octopart.com:80/conflict_mineral_statement/Yageo-company-3.pdf?src-supplier=Compliance+Statements; ComponentLink18Description: http://sigma.octopart.com:80/conflict_mineral_statement/Yageo-company-3.pdf?src-supplier=Compliance+Statements; ComponentLink19URL: http://sigma.octopart.com:80/rohs_statement/Yageo-company-2.pdf?src-supplier=Compliance+Statements; ComponentLink19Description: http://sigma.octopart.com:80/rohs_statement/Yageo-company-2.pdf?src-supplier=Compliance+Statements
Q2-Q7 = IAUAN04S7N005: Insulated-Gate Field-Effect Transistor (IGFET), N-Channel, Enhancement, Body Diode, Pin 1 Source, 2 Source, 3 Source, 4 Source, 5 Gate, 6 Drain, 6 Pins; Manufacturer Order Number: IST006N04NM6; Manufacturer: Infineon Technologies; PackageReference: PG-HSOF-5-4
R21-R23 R27-R29 = 0402WGF470KTCE: -55℃~+155℃ 4.7Ω 50V 62.5mW Thick Film Resistor ±1% ±200ppm/℃ 0402 Chip Resistor - Surface Mount ROHS
R24-R26 = HoCGX2512-3W-1.5mR-1%: 1.5mΩ 3W Current Sense Resistor SMD ±1% ±25ppm/℃ 2512 Current Sense Resistors / Shunt Resistors ROHS
R30-R32 = 0402WGF1001TCE: -55℃~+155℃ 1kΩ 50V 62.5mW Thick Film Resistor ±1% ±100ppm/℃ 0402 Chip Resistor - Surface Mount ROHS
R33 = NCP15XH103F03RC: -40℃~+125℃ 0.5mm 100mW 10kΩ 1mW/℃ 1mm 310uA 3380K 3434K 3455K ±1% ±1% 0402 NTC Thermistors ROHS
R34 = 0402WGF1002TCE: -55℃~+155℃ 10kΩ 50V 62.5mW Thick Film Resistor ±1% ±100ppm/℃ 0402 Chip Resistor - Surface Mount ROHS
U8-U10 = INA296A3IDDFR: -30V~+30V -40℃~+125℃ -5V~110V 1 1.1MHz 100nV/℃ 166dB 2.5mA 2.7V~20V 20V 35uA 39nV/√Hz@1kHz 3uV 50V/V 8V/us SOT-23 Current Sense Amplifiers ROHS
U11-U13 = SN74LVC1G66DCKR: -40℃~+85℃ 1 1.65V~5.5V 13pF 195MHz 1:1 4.2ns 5.5Ω 5ns 600ps SC-70-5 Analog Switches, Multiplexers ROHS